# Altium project 2003A.PrjPCB
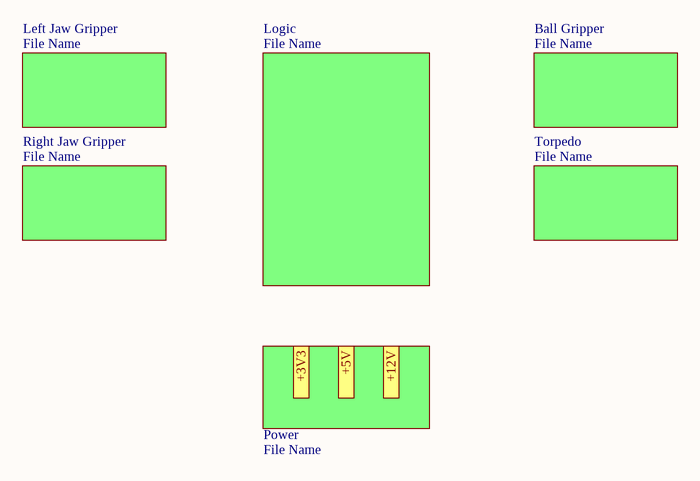
[diagram p0: 2003A.SchDoc]
11 sheets, 88 parts. Net scope: flat (ports and power ports of the same name join across sheets).
Sheets:
  2003A.SchDoc
  Programming Connector.SchDoc
  Communication Interfaces Connectors.SchDoc
  Jaw Gripper's Motors Connectors.SchDoc
  Torpedo Module Control Connector.SchDoc
  Free Pins Headers.SchDoc
  Ball Gripper's Motor Connector.SchDoc
  Ball Gripper Circuits.SchDoc
  Ball Gripper's Diodes and Fototransistors Connectors.SchDoc
  Power Circuits.SchDoc
  MCU.SchDoc

## Sheet 2003A.SchDoc
size A4

### Sub-sheets
Ball Gripper = File Name (file not in this document): no entries
Left Jaw Gripper = File Name (file not in this document): no entries
Logic = File Name (file not in this document): no entries
Power = File Name (file not in this document): no entries
Right Jaw Gripper = File Name (file not in this document): no entries
Torpedo = File Name (file not in this document): no entries

### Ports
+3V3, +5V, +12V

## Sheet Programming Connector.SchDoc
size A4
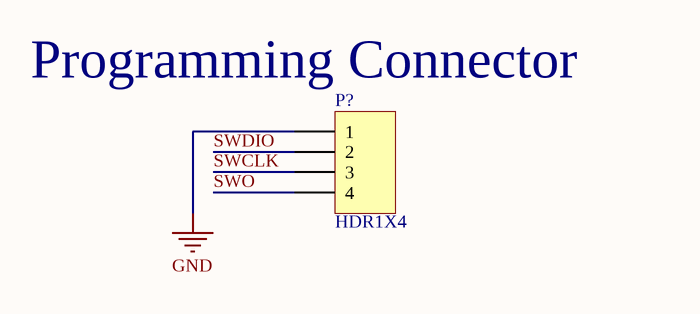
[diagram p1: Programming Connector.SchDoc]

### Parts
(Parts that share a designator on the sheet are numbered #1, #2 ... from top to bottom, then left to right.)
P?#1  HDR1X4  [Molex SPOX Horizontal 4 Circuits]

### Nets
GND: P?#1.1
SWCLK: P?#1.3
SWDIO: P?#1.2
SWO: P?#1.4

### Notes on the sheet
- (near P?#1) Programming Connector

### Library data of the parts
P?#1 = HDR1X4: Header, 4-Pin; LatestRevisionDate: 17-Jul-2002; LatestRevisionNote: Re-released for DXP Platform.; Publisher: Altium Limited

## Sheet Communication Interfaces Connectors.SchDoc
size A4
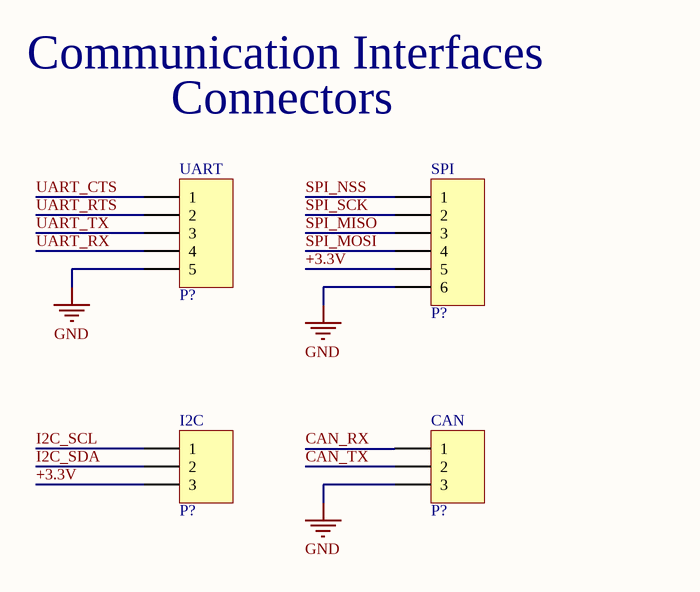
[diagram p2: Communication Interfaces Connectors.SchDoc]

### Parts
(Parts that share a designator on the sheet are numbered #1, #2 ... from top to bottom, then left to right.)
P?#2  HDR1X5  [Molex SPOX Horizontal 5 Circuits]  (value not drawn)
P?#3  HDR1X6  [Molex SPOX Horizontal 6 Circuits]  (value not drawn)
P?#4  HDR1X3  [Molex SPOX Horizontal 3 Circuits]  (value not drawn)
P?#5  HDR1X3  [HDR1X3]  (value not drawn)

### Nets
GND: P?#2.5 P?#3.6 P?#5.3
+3.3V: P?#3.5 P?#4.3
CAN_RX: P?#5.1
CAN_TX: P?#5.2
I2C_SCL: P?#4.1
I2C_SDA: P?#4.2
SPI_MISO: P?#3.3
SPI_MOSI: P?#3.4
SPI_NSS: P?#3.1
SPI_SCK: P?#3.2
UART_CTS: P?#2.1
UART_RTS: P?#2.2
UART_RX: P?#2.4
UART_TX: P?#2.3

### Notes on the sheet
- Communication Interfaces
- Connectors
- (near P?#2) UART
- (near P?#3) SPI
- (near P?#4) I2C
- (near P?#5) CAN

### Library data of the parts
P?#2 = HDR1X5: Header, 5-Pin; LatestRevisionDate: 17-Jul-2002; LatestRevisionNote: Re-released for DXP Platform.; Publisher: Altium Limited
P?#3 = HDR1X6: Header, 6-Pin; LatestRevisionDate: 17-Jul-2002; LatestRevisionNote: Re-released for DXP Platform.; Publisher: Altium Limited
P?#4 P?#5 = HDR1X3: Header, 3-Pin; LatestRevisionDate: 17-Jul-2002; LatestRevisionNote: Re-released for DXP Platform.; Publisher: Altium Limited

## Sheet Jaw Gripper's Motors Connectors.SchDoc
size A4
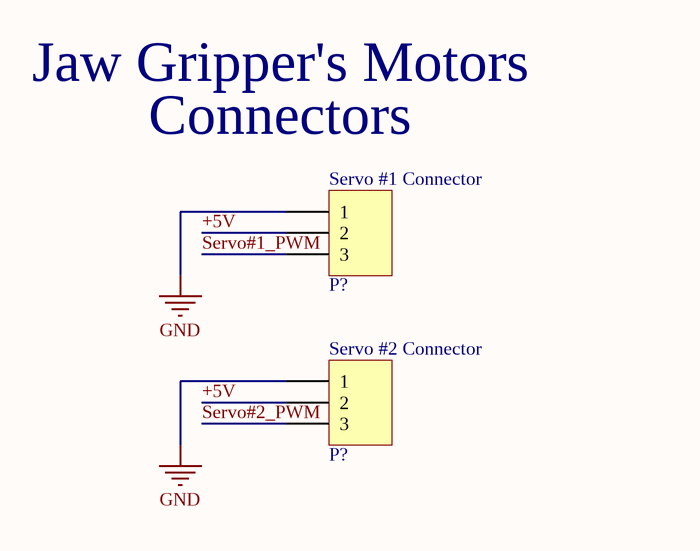
[diagram p3: Jaw Gripper's Motors Connectors.SchDoc]

### Parts
(Parts that share a designator on the sheet are numbered #1, #2 ... from top to bottom, then left to right.)
P?#6  HDR1X3  [Molex SPOX Horizontal 3 Circuits]  (value not drawn)
P?#7  HDR1X3  [Molex SPOX Horizontal 3 Circuits]  (value not drawn)

### Nets
GND: P?#6.1 P?#7.1
+5V: P?#6.2 P?#7.2
Servo#1_PWM: P?#6.3
Servo#2_PWM: P?#7.3

### Notes on the sheet
- Jaw Gripper's Motors
- (near P?#6) Connectors
- (near P?#6) Servo #1 Connector
- (near P?#7) Servo #2 Connector

### Library data of the parts
P?#6 P?#7 = HDR1X3: Header, 3-Pin; LatestRevisionDate: 17-Jul-2002; LatestRevisionNote: Re-released for DXP Platform.; Publisher: Altium Limited

## Sheet Torpedo Module Control Connector.SchDoc
size A4
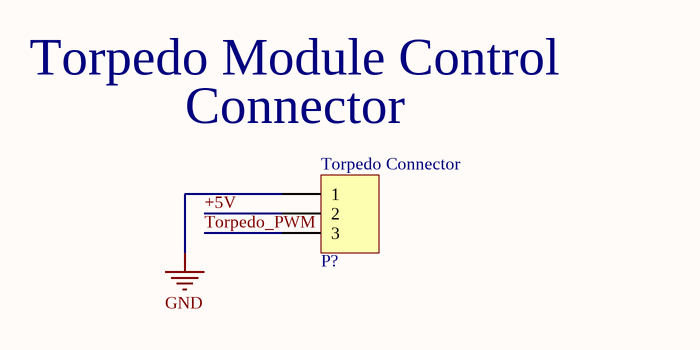
[diagram p4: Torpedo Module Control Connector.SchDoc]

### Parts
(Parts that share a designator on the sheet are numbered #1, #2 ... from top to bottom, then left to right.)
P?#8  HDR1X3  [Molex SPOX Horizontal 3 Circuits]  (value not drawn)

### Nets
GND: P?#8.1
+5V: P?#8.2
Torpedo_PWM: P?#8.3

### Notes on the sheet
- Torpedo Module Control
- (near P?#8) Connector
- (near P?#8) Torpedo Connector

### Library data of the parts
P?#8 = HDR1X3: Header, 3-Pin; LatestRevisionDate: 17-Jul-2002; LatestRevisionNote: Re-released for DXP Platform.; Publisher: Altium Limited

## Sheet Free Pins Headers.SchDoc
size A4
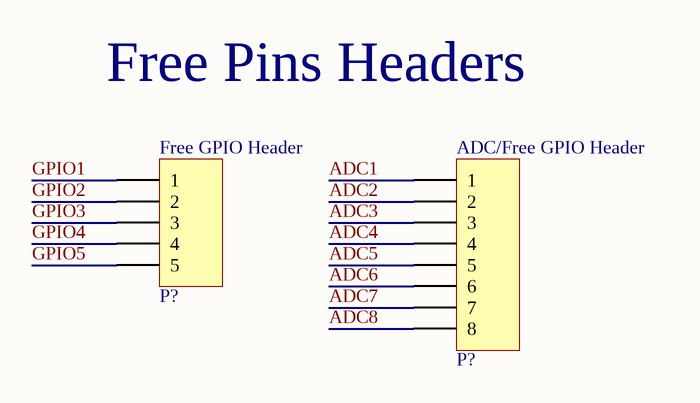
[diagram p5: Free Pins Headers.SchDoc]

### Parts
(Parts that share a designator on the sheet are numbered #1, #2 ... from top to bottom, then left to right.)
P?#9  HDR1X5  [HDR1X5]  (value not drawn)
P?#10  HDR1X8  [HDR1X8]  (value not drawn)

### Nets
ADC1: P?#10.1
ADC2: P?#10.2
ADC3: P?#10.3
ADC4: P?#10.4
ADC5: P?#10.5
ADC6: P?#10.6
ADC7: P?#10.7
ADC8: P?#10.8
GPIO1: P?#9.1
GPIO2: P?#9.2
GPIO3: P?#9.3
GPIO4: P?#9.4
GPIO5: P?#9.5

### Notes on the sheet
- Free Pins Headers
- (near P?#9) Free GPIO Header
- (near P?#10) ADC/Free GPIO Header

### Library data of the parts
P?#9 = HDR1X5: Header, 5-Pin; LatestRevisionDate: 17-Jul-2002; LatestRevisionNote: Re-released for DXP Platform.; Publisher: Altium Limited
P?#10 = HDR1X8: Header, 8-Pin; LatestRevisionDate: 17-Jul-2002; LatestRevisionNote: Re-released for DXP Platform.; Publisher: Altium Limited

## Sheet Ball Gripper's Motor Connector.SchDoc
size A4
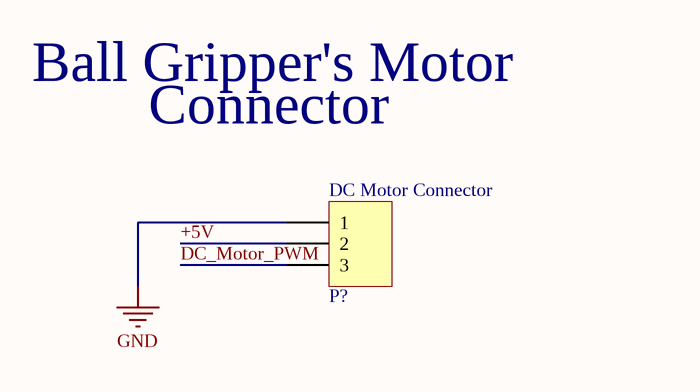
[diagram p6: Ball Gripper's Motor Connector.SchDoc]

### Parts
(Parts that share a designator on the sheet are numbered #1, #2 ... from top to bottom, then left to right.)
P?#11  HDR1X3  [Molex SPOX Horizontal 3 Circuits]  (value not drawn)

### Nets
GND: P?#11.1
+5V: P?#11.2
DC_Motor_PWM: P?#11.3

### Notes on the sheet
- Ball Gripper's Motor
- Connector
- (near P?#11) DC Motor Connector

### Library data of the parts
P?#11 = HDR1X3: Header, 3-Pin; LatestRevisionDate: 17-Jul-2002; LatestRevisionNote: Re-released for DXP Platform.; Publisher: Altium Limited

## Sheet Ball Gripper Circuits.SchDoc
size A4
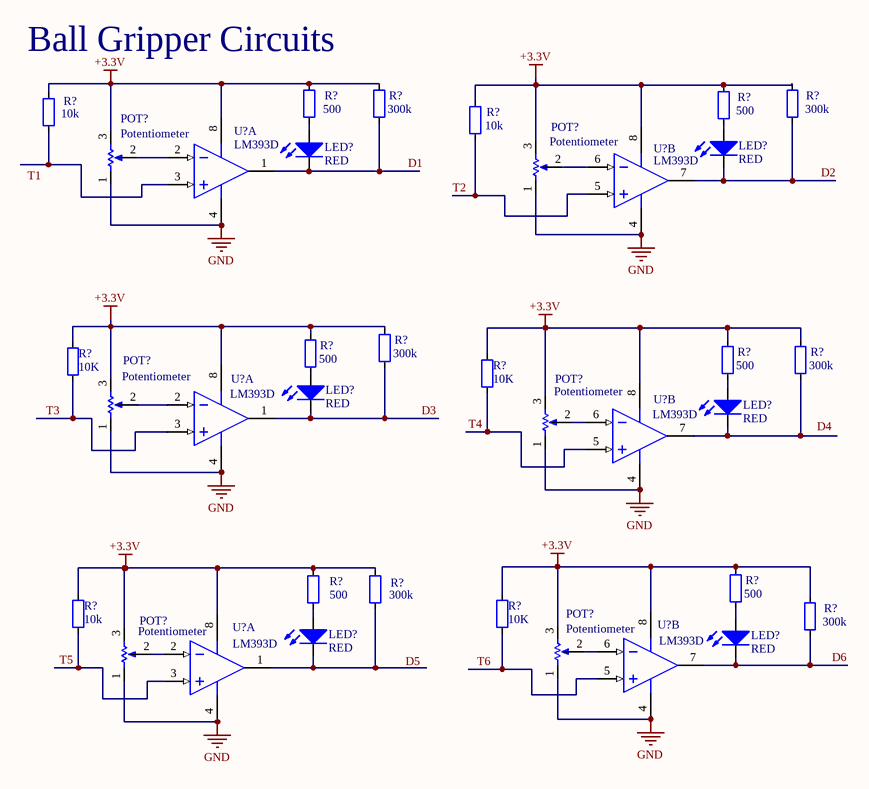
[diagram p7: Ball Gripper Circuits.SchDoc]

### Parts
(Parts that share a designator on the sheet are numbered #1, #2 ... from top to bottom, then left to right.)
LED?#1  RED  [0603_led_red]
LED?#2  RED  [0603_led_red]
LED?#3  RED  [0603_led_red]
LED?#4  RED  [0603_led_red]
LED?#5  RED  [0603_led_red]
LED?#6  RED  [0603_led_red]
POT?#1  Potentiometer  [Pot_3296]
POT?#2  Potentiometer  [Pot_3296]
POT?#3  Potentiometer  [Pot_3296]
POT?#4  Potentiometer  [Pot_3296]
POT?#5  Potentiometer  [Pot_3296]
POT?#6  Potentiometer  [Pot_3296]
R?#1  500  [0603]
R?#2  300k  [0603]
R?#3  500  [0603]
R?#4  300k  [0603]
R?#5  10k  [0603]
R?#6  10k  [0603]
R?#7  300k  [0603]
R?#8  500  [0603]
R?#9  10K  [0603]
R?#10  500  [0603]
R?#11  300k  [0603]
R?#12  10K  [0603]
R?#13  500  [0603]
R?#14  300k  [0603]
R?#15  500  [0603]
R?#16  10k  [0603]
R?#17  10K  [0603]
R?#18  300k  [0603]
U?#1  LM393D  [SO8_N]  (part A of 2)
U?#2  LM393D  [SO8_N]  (part B of 2)
U?#3  LM393D  [SO8_N]  (part A of 2)
U?#4  LM393D  [SO8_N]  (part B of 2)
U?#5  LM393D  [SO8_N]  (part A of 2)
U?#6  LM393D  [SO8_N]  (part B of 2)

### Nets
+3.3V: POT?#1.3 POT?#2.3 POT?#3.3 POT?#4.3 POT?#5.3 POT?#6.3 R?#1.2 R?#2.2 R?#3.2 R?#4.2 R?#5.2 R?#6.2 R?#7.2 R?#8.2 R?#9.2 R?#10.2 R?#11.2 R?#12.2 R?#13.2 R?#14.2 R?#15.2 R?#16.2 R?#17.2 R?#18.2 U?#1.8(V+) U?#2.8(V+) U?#3.8(V+) U?#4.8(V+) U?#5.8(V+) U?#6.8(V+)
GND: POT?#1.1 POT?#2.1 POT?#3.1 POT?#4.1 POT?#5.1 POT?#6.1 U?#1.4(V-) U?#2.4(V-) U?#3.4(V-) U?#4.4(V-) U?#5.4(V-) U?#6.4(V-)
D1: LED?#2.2(K) R?#2.1 U?#1.1(OUT)
D2: LED?#1.2(K) R?#4.1 U?#2.7(OUT)
D3: LED?#3.2(K) R?#7.1 U?#3.1(OUT)
D6: LED?#6.2(K) R?#18.1 U?#6.7(OUT)
T2: R?#6.1 U?#2.5(IN+)
T3: R?#9.1 U?#3.3(IN+)
T4: R?#12.1 U?#4.5(IN+)
T5: R?#16.1 U?#5.3(IN+)
T6: R?#17.1 U?#6.5(IN+)
NetLED?#1_1: LED?#1.1(A) R?#3.1
NetLED?#2_1: LED?#2.1(A) R?#1.1
NetLED?#3_1: LED?#3.1(A) R?#8.1
NetLED?#4_1: LED?#4.1(A) R?#10.1
NetLED?#4_2: LED?#4.2(K) R?#11.1 U?#4.7(OUT)
NetLED?#5_1: LED?#5.1(A) R?#13.1
NetLED?#5_2: LED?#5.2(K) R?#14.1 U?#5.1(OUT)
NetLED?#6_1: LED?#6.1(A) R?#15.1
NetPOT?#1_2: POT?#1.2 U?#1.2(IN-)
NetPOT?#2_2: POT?#2.2 U?#2.6(IN-)
NetPOT?#3_2: POT?#3.2 U?#3.2(IN-)
NetPOT?#4_2: POT?#4.2 U?#4.6(IN-)
NetPOT?#5_2: POT?#5.2 U?#5.2(IN-)
NetPOT?#6_2: POT?#6.2 U?#6.6(IN-)
NetR?#5_1: R?#5.1 U?#1.3(IN+)

### Notes on the sheet
- (near R?#2) Ball Gripper Circuits
- Labels drawn without touching a wire or pin: D4, D5, T1

### Library data of the parts
LED?#1-LED?#6 = LED: Light-emitting diode; COLOR: RED
R?#1-R?#18 = RES: Resistior
  R?#1 R?#3 R?#8 R?#10 R?#13 R?#15: Value: 500
  R?#2 R?#4 R?#7 R?#11 R?#14 R?#18: Value: 300k
  R?#5 R?#6 R?#16: Value: 10k
  R?#9 R?#12 R?#17: Value: 10K
U?#1-U?#6 = LM393D: Low-Power Dual Voltage Comparator; Published: 24-Aug-2001; LatestRevisionDate: 13-Apr-2006; LatestRevisionNote: IPC-7351 Footprint Added.; DatasheetVersion: Jun-1998; PackageVersion: Dec-2002; PackageReference: SO8; Publisher: Altium Limited; PackageDescription: 8-Pin Small Outline Integrated Circuit 1.27 mm Pitch; Code_JEDEC: MS-012-AA; Code_IPC: SOIC127P600-8; ComponentLink1Description: Manufacturer Link; ComponentLink1URL: http://www.st.com/; ComponentLink2Description: Datasheet; ComponentLink2URL: http://www.st.com/stonline/products/literature/ds/2164/lm293.pdf

## Sheet Ball Gripper's Diodes and Fototransistors Connectors.SchDoc
size A4
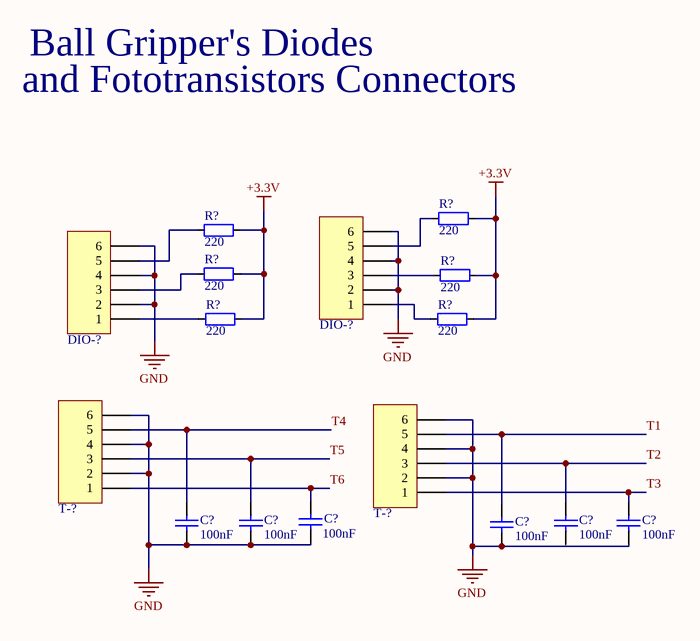
[diagram p8: Ball Gripper's Diodes and Fototransistors Connectors.SchDoc]

### Parts
(Parts that share a designator on the sheet are numbered #1, #2 ... from top to bottom, then left to right.)
C?#1  value 100nF  [0603_CAP]  (hidden comment: Cap)
C?#2  value 100nF  [0603_CAP]  (hidden comment: Cap)
C?#3  value 100nF  [0603_CAP]  (hidden comment: Cap)
C?#4  value 100nF  [0603_CAP]  (hidden comment: Cap)
C?#5  value 100nF  [0603_CAP]  (hidden comment: Cap)
C?#6  value 100nF  [0603_CAP]  (hidden comment: Cap)
DIO-?#1  HDR1X6  [Molex SPOX Horizontal 6 Circuits]  (value not drawn)
DIO-?#2  HDR1X6  [Molex SPOX Horizontal 6 Circuits]  (value not drawn)
R?#19  220  [0603]
R?#20  220  [0603]
R?#21  220  [0603]
R?#22  220  [0603]
R?#23  220  [0603]
R?#24  220  [0603]
T-?#1  HDR1X6  [Molex SPOX Horizontal 6 Circuits]  (value not drawn)
T-?#2  HDR1X6  [Molex SPOX Horizontal 6 Circuits]  (value not drawn)

### Nets
+3.3V: R?#19.1 R?#20.1 R?#21.1 R?#22.1 R?#23.1 R?#24.1
GND: C?#1.1 C?#2.1 C?#3.1 C?#4.1 C?#6.1 DIO-?#1.2 DIO-?#1.4 DIO-?#1.6 DIO-?#2.2 DIO-?#2.4 DIO-?#2.6 T-?#1.2 T-?#1.4 T-?#1.6 T-?#2.2 T-?#2.4 T-?#2.6
T1: C?#4.2 T-?#2.5
T2: C?#5.2 T-?#2.3
T3: C?#6.2 T-?#2.1
T4: C?#1.2 T-?#1.5
T5: C?#2.2 T-?#1.3
T6: C?#3.2 T-?#1.1
NetDIO-?#1_1: DIO-?#1.1 R?#24.2
NetDIO-?#1_3: DIO-?#1.3 R?#22.2
NetDIO-?#1_5: DIO-?#1.5 R?#19.2
NetDIO-?#2_1: DIO-?#2.1 R?#23.2
NetDIO-?#2_3: DIO-?#2.3 R?#21.2
NetDIO-?#2_5: DIO-?#2.5 R?#20.2

Not connected (* = marked no-connect by the designer): C?#5 1

### Notes on the sheet
- Ball Gripper's Diodes
- and Fototransistors Connectors

### Library data of the parts
C?#1-C?#6 = Cap: Ceramic capacitor; Unit Price1: *; Unit Price2: *
DIO-?#1 DIO-?#2 T-?#1 T-?#2 = HDR1X6: Header, 6-Pin; LatestRevisionDate: 17-Jul-2002; LatestRevisionNote: Re-released for DXP Platform.; Publisher: Altium Limited
R?#19-R?#24 = RES: Resistior; Value: 220

## Sheet Power Circuits.SchDoc
size A4
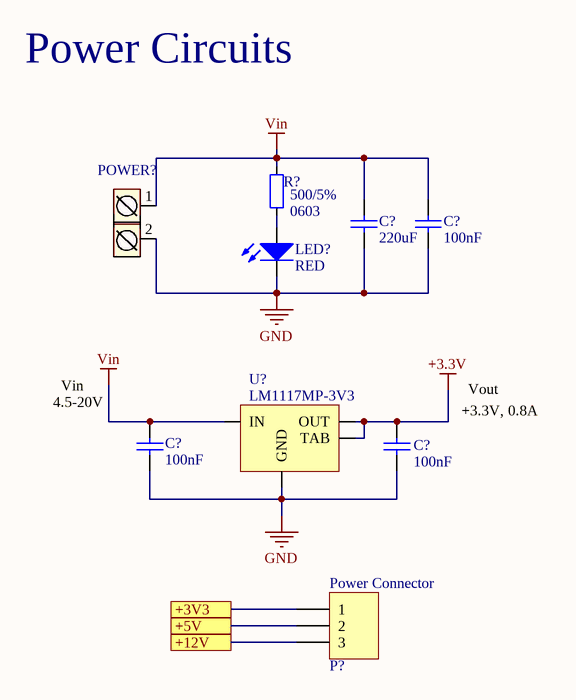
[diagram p9: Power Circuits.SchDoc]

### Parts
(Parts that share a designator on the sheet are numbered #1, #2 ... from top to bottom, then left to right.)
C?#7  value 220uF  [0603_CAP]  (hidden comment: Cap)
C?#8  value 100nF  [0603_CAP]  (hidden comment: Cap)
C?#9  value 100nF  [0603_CAP]  (hidden comment: Cap)
C?#10  value 100nF  [0603_CAP]  (hidden comment: Cap)
LED?#7  RED  [0603_led_red]
P?#12  HDR1X3  [Molex SPOX Horizontal 3 Circuits]  (value not drawn)
POWER?  ARK2  [ARK2]  (value not drawn)
R?#25  500/5%  [0603]
U?#7  LM1117MP-3V3  [SOT223]

### Ports
+3V3, +5V, +12V

### Nets
+3.3V: C?#10.1 U?#7.2(OUT) U?#7.4(TAB)
GND: C?#7.1 C?#8.1 C?#9.2 C?#10.2 LED?#7.2(K) POWER?.2 U?#7.1(GND)
Vin: C?#7.2 C?#8.2 C?#9.1 POWER?.1 R?#25.2 U?#7.3(IN)
NetLED?#7_1: LED?#7.1(A) R?#25.1
NetP?#12_1: P?#12.1 ; port +3V3
NetP?#12_2: P?#12.2 ; port +5V
NetP?#12_3: P?#12.3 ; port +12V

### Notes on the sheet
- Power Circuits
- (near C?#9) 4.5-20V
- Vin
- +3.3V, 0.8A
- Vout
- (near P?#12) Power Connector

### Library data of the parts
C?#7-C?#10 = Cap: Ceramic capacitor; Unit Price1: *; Unit Price2: *
LED?#7 = LED: Light-emitting diode; COLOR: RED
P?#12 = HDR1X3: Header, 3-Pin; LatestRevisionDate: 17-Jul-2002; LatestRevisionNote: Re-released for DXP Platform.; Publisher: Altium Limited
POWER? = ARK2: Złącze śrubowe 2 piny
R?#25 = RES: Resistior; Value: 500/5%; Package: 0603
U?#7 = LM1117MP-3V3: 800mA Low-Dropout Linear Regulator; PartNumber: LM1117MP-3.3; Manufacturer: National Semiconductor; CompType: LDO IC; PackageTopMarking: XYTT*N05A; PowerWise: N; DatasheetVersion: Apr-2006; PackageVersion: revB, Apr-2003; PackageReference: MP04A; PackageDescription: Molded SOT-223, 6.50 x 3.56 x 1.6mm Body, 4 Lead, 2.3mm Pitch; ComponentLink1Description: LM1117 Datasheet; ComponentLink1URL: http://www.national.com/ds/LM/LM1117.pdf; ComponentLink2Description: LM1117 Web Page; ComponentLink2URL: http://www.national.com/pf/LM/LM1117.html; Published: 4-Dec-2008; Publisher: Altium Limited; RoHS: O; PinCount: 4; DigiKeyPartNumber: LM1117MP-3.3CT-ND; Code_JEDEC: TO-261-AA; Code_IPC: SOT223-4; ComponentLink3Description: MP04A Package Page; ComponentLink3URL: http://www.national.com/packaging/folders/mp04a.html

## Sheet MCU.SchDoc
size A4
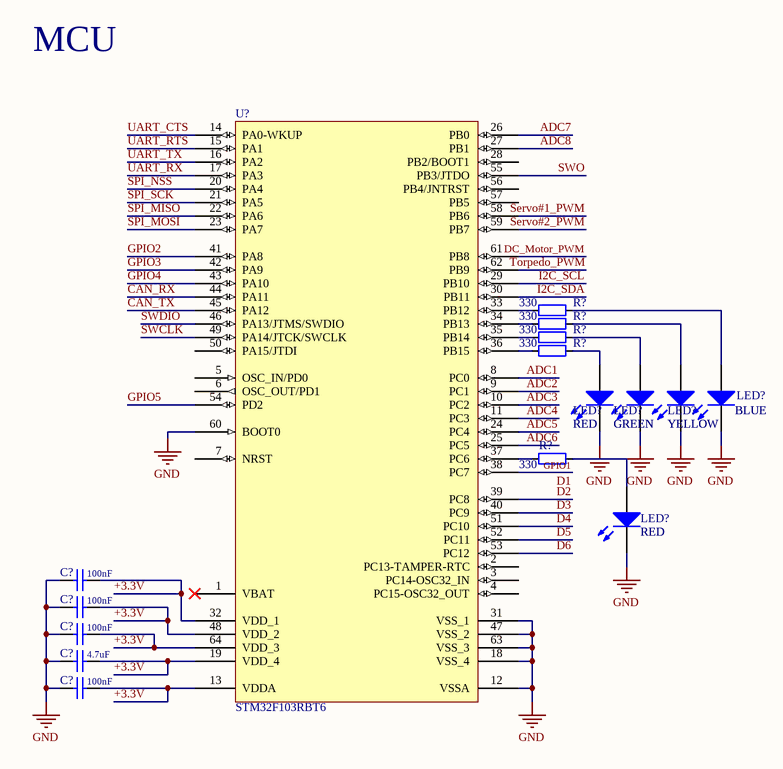
[diagram p10: MCU.SchDoc]

### Parts
(Parts that share a designator on the sheet are numbered #1, #2 ... from top to bottom, then left to right.)
C?#11  value 100nF  [0603_CAP]  (hidden comment: Cap)
C?#12  value 100nF  [0603_CAP]  (hidden comment: Cap)
C?#13  value 100nF  [0603_CAP]  (hidden comment: Cap)
C?#14  value 4.7uF  [0603_CAP]  (hidden comment: Cap)
C?#15  value 100nF  [0603_CAP]  (hidden comment: Cap)
LED?#8  RED  [LED_THT_RED]
LED?#9  GREEN  [LED_THT_YELLOW]
LED?#10  YELLOW  [LED_THT_GREEN]
LED?#11  BLUE  [LED_THT_BLUE]
LED?#12  RED  [LED_THT_RED]
R?#26  330  [0603]
R?#27  330  [0603]
R?#28  330  [0603]
R?#29  330  [0603]
R?#30  330  [0603]
U?#8  STM32F103RBT6  [LQFP64_L]

### Nets
GND: C?#11.1 C?#12.1 C?#13.1 C?#14.1 C?#15.1 LED?#8.2(K) LED?#9.2(K) LED?#10.2(K) LED?#11.2(K) LED?#12.2(K) U?#8.12(VSSA) U?#8.18(VSS_4) U?#8.31(VSS_1) U?#8.47(VSS_2) U?#8.60(BOOT0) U?#8.63(VSS_3)
+3.3V: C?#11.2 C?#12.2 C?#13.2 C?#14.2 C?#15.2 U?#8.13(VDDA) U?#8.19(VDD_4) U?#8.32(VDD_1) U?#8.48(VDD_2) U?#8.64(VDD_3)
ADC1: U?#8.8(PC0)
ADC2: U?#8.9(PC1)
ADC3: U?#8.10(PC2)
ADC4: U?#8.11(PC3)
ADC5: U?#8.24(PC4)
ADC6: U?#8.25(PC5)
ADC7: U?#8.26(PB0)
ADC8: U?#8.27(PB1)
CAN_RX: U?#8.44(PA11)
CAN_TX: U?#8.45(PA12)
D1: U?#8.38(PC7)  [also labelled GPIO1]
D2: U?#8.39(PC8)
D3: U?#8.40(PC9)
D4: U?#8.51(PC10)
D5: U?#8.52(PC11)
D6: U?#8.53(PC12)
DC_Motor_PWM: U?#8.61(PB8)
GPIO2: U?#8.41(PA8)
GPIO3: U?#8.42(PA9)
GPIO4: U?#8.43(PA10)
GPIO5: U?#8.54(PD2)
I2C_SCL: U?#8.29(PB10)
I2C_SDA: U?#8.30(PB11)
Servo#1_PWM: U?#8.58(PB6)
Servo#2_PWM: U?#8.59(PB7)
SPI_MISO: U?#8.22(PA6)
SPI_MOSI: U?#8.23(PA7)
SPI_NSS: U?#8.20(PA4)
SPI_SCK: U?#8.21(PA5)
SWCLK: U?#8.49(PA14/JTCK/SWCLK)
SWDIO: U?#8.46(PA13/JTMS/SWDIO)
SWO: U?#8.55(PB3/JTDO)
Torpedo_PWM: U?#8.62(PB9)
UART_CTS: U?#8.14(PA0-WKUP)
UART_RTS: U?#8.15(PA1)
UART_RX: U?#8.17(PA3)
UART_TX: U?#8.16(PA2)
NetLED?#8_1: LED?#8.1(A) R?#29.2
NetLED?#9_1: LED?#9.1(A) R?#28.2
NetLED?#10_1: LED?#10.1(A) R?#27.2
NetLED?#11_1: LED?#11.1(A) R?#26.2
NetLED?#12_1: LED?#12.1(A) R?#30.2
NetR?#26_1: R?#26.1 U?#8.33(PB12)
NetR?#27_1: R?#27.1 U?#8.34(PB13)
NetR?#28_1: R?#28.1 U?#8.35(PB14)
NetR?#29_1: R?#29.1 U?#8.36(PB15)
NetR?#30_1: R?#30.1 U?#8.37(PC6)

Not connected (* = marked no-connect by the designer): U?#8 1(VBAT)* 2(PC13-TAMPER-RTC) 3(PC14-OSC32_IN) 4(PC15-OSC32_OUT) 5(OSC_IN/PD0) 6(OSC_OUT/PD1) 7(NRST) 28(PB2/BOOT1) 50(PA15/JTDI) 56(PB4/JNTRST) 57(PB5)

### Notes on the sheet
- MCU

### Library data of the parts
C?#11-C?#15 = Cap: Ceramic capacitor; Unit Price1: *; Unit Price2: *
LED?#8-LED?#12 = LED: Light-emitting diode
  LED?#8 LED?#12: COLOR: RED
  LED?#9: COLOR: GREEN
  LED?#10: COLOR: YELLOW
  LED?#11: COLOR: BLUE
R?#26-R?#30 = RES: Resistior; Value: 330
U?#8 = STM32F103RBT6: STM32 ARM-based 32-bit; Published: 30-May-2008; DatasheetVersion: rev6, Mar-2008; PackageVersion: Mar-2008; PackageReference: LQFP64; Publisher: Altium Limited; PackageDescription: 64-Pin Low-Profile Quad Flat Pack, 10 x 10 mm Body, 0.5 mm Pitch (LQFP64); ComponentLink1Description: Manufacturer Link; ComponentLink1URL: www.st.com/stm32; ComponentLink2Description: Datasheet; ComponentLink2URL: http://www.st.com/stonline/products/literature/ds/13587.pdf

## Nets that join several sheets
+3.3V: Ball Gripper Circuits (30 pins), Ball Gripper's Diodes and Fototransistors Connectors (6 pins), Power Circuits (C?#10.1 U?#7.2 U?#7.4)
GND: Programming Connector (P?#1.1), Communication Interfaces Connectors (P?#2.5 P?#3.6 P?#5.3), Jaw Gripper's Motors Connectors (P?#6.1 P?#7.1), Torpedo Module Control Connector (P?#8.1), Ball Gripper's Motor Connector (P?#11.1), Ball Gripper Circuits (12 pins), Ball Gripper's Diodes and Fototransistors Connectors (17 pins), Power Circuits (7 pins), MCU (16 pins)